# EAGLE design Power-Monitor-Module (EAGLE 9.6.2)
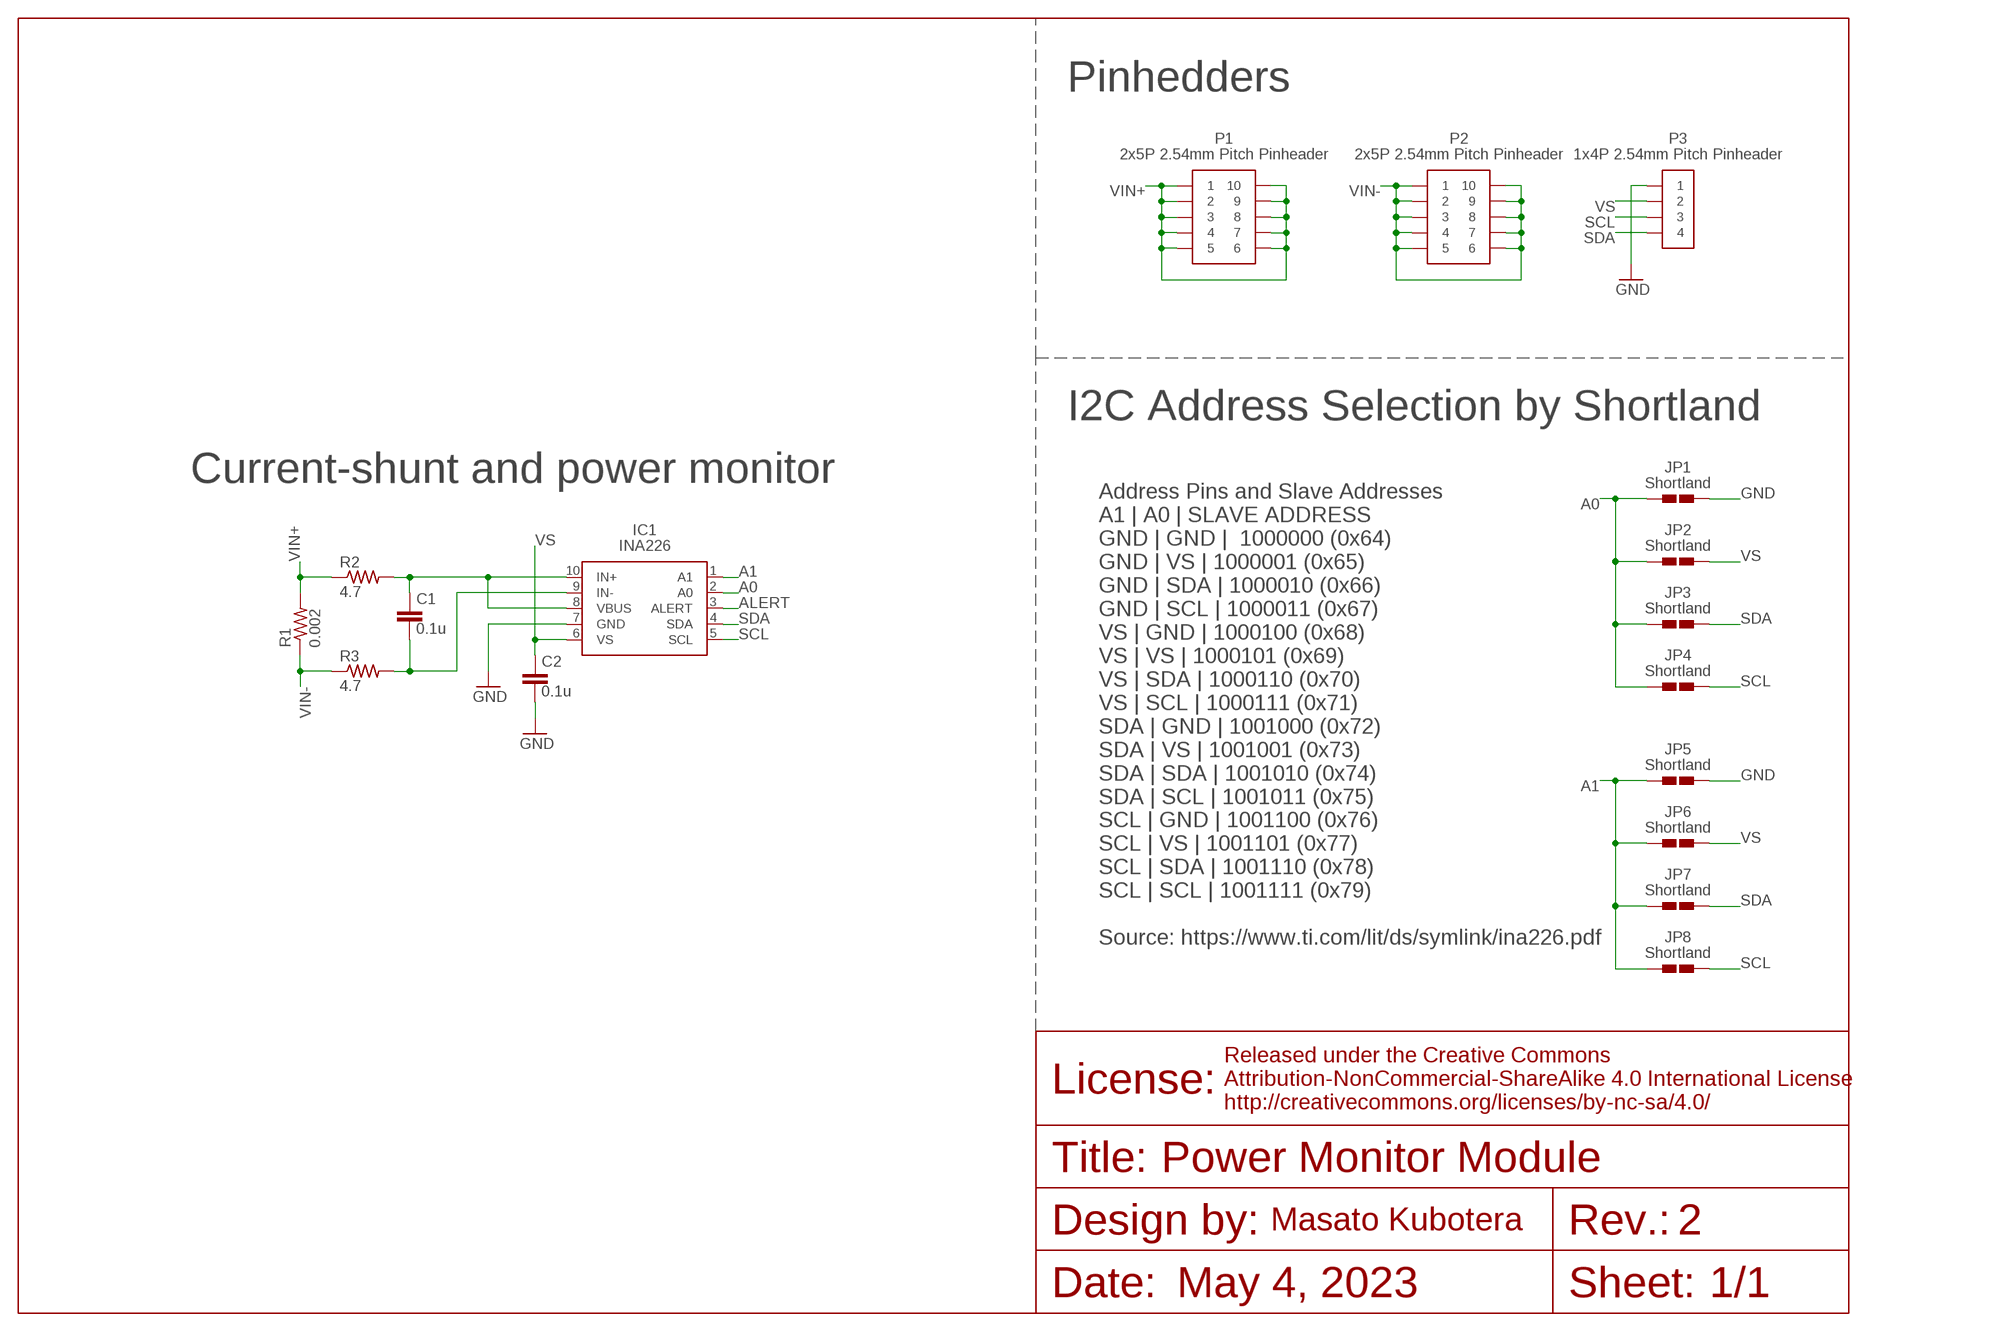
[diagram p0: schematic, sheet 1]

## Parts
C1  0.1u  C-EUC0402  [C0402]
C2  0.1u  C-EUC0402  [C0402]
IC1  INA226  [MSOP-10]
JP1  SHORTLAND  [SHORTLAND]
JP2  SHORTLAND  [SHORTLAND]
JP3  SHORTLAND  [SHORTLAND]
JP4  SHORTLAND  [SHORTLAND]
JP5  SHORTLAND  [SHORTLAND]
JP6  SHORTLAND  [SHORTLAND]
JP7  SHORTLAND  [SHORTLAND]
JP8  SHORTLAND  [SHORTLAND]
P1  2X5P  [2X5P]
P2  2X5P  [2X5P]
P3  1X4P  [1X4P]
R1  0.002  R-US_R2512  [R2512]
R2  4.7  R-US_R0402  [R0402]
R3  4.7  R-US_R0402  [R0402]

## Nets
A0 [data]: IC1.2(A0) JP1.1 JP2.1 JP3.1 JP4.1
A1 [data]: IC1.1(A1) JP5.1 JP6.1 JP7.1 JP8.1
ALERT [data]: IC1.3(ALERT)
GND [power]: C2.2 IC1.7(GND) JP1.2 JP5.2 P3.1
IN+ [power]: C1.1 IC1.8(VBUS) IC1.10(IN+) R2.2
IN- [power]: C1.2 IC1.9(IN-) R3.2
SCL [data]: IC1.5(SCL) JP4.2 JP8.2 P3.3
SDA [data]: IC1.4(SDA) JP3.2 JP7.2 P3.4
VIN+: P1.1 P1.2 P1.3 P1.4 P1.5 P1.6 P1.7 P1.8 P1.9 P1.10 R1.2 R2.1
VIN-: P2.1 P2.2 P2.3 P2.4 P2.5 P2.6 P2.7 P2.8 P2.9 P2.10 R1.1 R3.1
VS [power]: C2.1 IC1.6(VS) JP2.2 JP6.2 P3.2

## Notes on the sheet
- Pinhedders
- I2C Address Selection by Shortland
- Current-shunt and power monitor
- Address Pins and Slave Addresses
  A1 | A0 | SLAVE ADDRESS
  GND | GND |  1000000 (0x64)
  GND | VS | 1000001 (0x65)
  GND | SDA | 1000010 (0x66)
  GND | SCL | 1000011 (0x67)
  VS | GND | 1000100 (0x68)
  VS | VS | 1000101 (0x69)
  VS | SDA | 1000110 (0x70)
  VS | SCL | 1000111 (0x71)
  SDA | GND | 1001000 (0x72)
  SDA | VS | 1001001 (0x73)
  SDA | SDA | 1001010 (0x74)
  SDA | SCL | 1001011 (0x75)
  SCL | GND | 1001100 (0x76)
  SCL | VS | 1001101 (0x77)
  SCL | SDA | 1001110 (0x78)
  SCL | SCL | 1001111 (0x79)
  
  Source: https://www.ti.com/lit/ds/symlink/ina226.pdf
- Power Monitor Module
- 2
- May 4, 2023 | 1/1

## Library data of the parts
C1 C2 = rcl:C-EU: CAPACITOR, European symbol; SPICEPREFIX: C
IC1 = INA226:INA226
JP1-JP8 = Shortland:SHORTLAND
P1 P2 = Pinheader:2X5P
P3 = Pinheader:1X4P
R1-R3 = rcl:R-US_: RESISTOR, American symbol; SPICEPREFIX: R

## Net classes
1 data: width 0.152 mm
2 power: width 0.203 mm

## Board
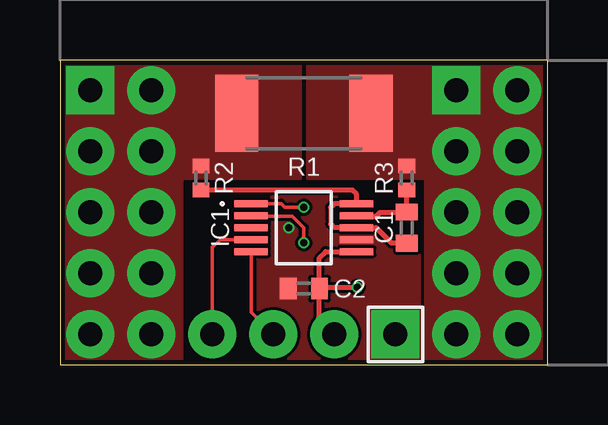
[diagram p1: board, top side]
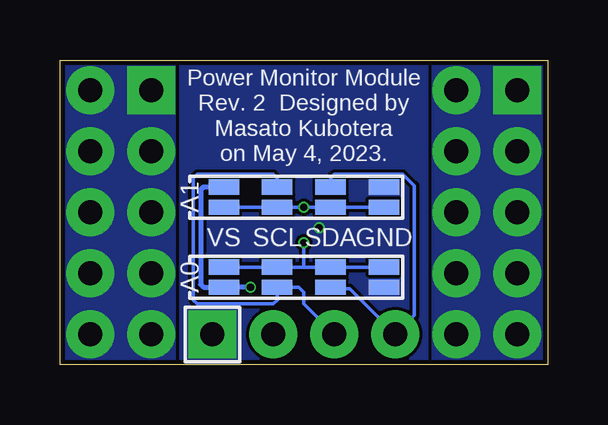
[diagram p2: board, bottom side, seen from below]

Size 20.32 x 12.7 mm. Coordinates in mm from the lower left corner, seen from the top.
Outline: 0,0 20.32,0 20.32,12.7 0,12.7 0,0
Copper layers (1*16): Top 0.035mm / dielectric 1.6mm / Bottom 0.035mm
Design rules "jlcpcb-2layers": minimum track width 5mil, minimum drill 0.3mm, track to track 5mil, track to pad 5mil, pad to pad 5mil, via to via 5mil, smd to smd 5mil, copper to edge 0.2mm, drill to drill 6mil, minimum pad ring 10mil, minimum via ring 3mil, stop-mask expansion 4mil, vias tented up to drill 0mil, thermal gap 10mil

### Footprints (pad centres in the part's own frame; a part is rotated, then mirrored left to right if it is on the bottom)
C0402 = smd 0.7 x 0.9: 1 -0.65,0; 2 0.65,0
MSOP-10 = smd 1.4 x 0.3: 1 -2.2,1; 2 -2.2,0.5; 3 -2.2,0; 4 -2.2,-0.5; 5 -2.2,-1; 6 2.2,-1; 7 2.2,-0.5; 8 2.2,0; 9 2.2,0.5; 10 2.2,1
SHORTLAND = smd 0.635 x 1.27: 1 -0.419,0; 2 0.419,0
2X5P = drill 1 pad 2 square: 1 -1.27,5.08 | drill 1 pad 2: 2 -1.27,2.54; 3 -1.27,0; 4 -1.27,-2.54; 5 -1.27,-5.08; 6 1.27,-5.08; 7 1.27,-2.54; 8 1.27,0; 9 1.27,2.54; 10 1.27,5.08
1X4P = drill 1 pad 2 square: 1 0,3.81 | drill 1 pad 2: 2 0,1.27; 3 0,-1.27; 4 0,-3.81
R2512 = smd 1.8 x 3.2: 1 -2.8,0; 2 2.8,0
R0402 = smd 0.6 x 0.7: 1 -0.5,0; 2 0.5,0

### Placement (x,y rotation side)
C1  14.45,5.71 90 top
C2  10.16,3.17 180 top
IC1  10.16,5.71 0 top
JP1  6.83,3.65 270 bottom
JP2  13.49,3.65 270 bottom
JP3  9.05,3.65 270 bottom
JP4  11.27,3.65 270 bottom
JP5  6.83,6.98 90 bottom
JP6  13.49,6.98 90 bottom
JP7  9.05,6.98 90 bottom
JP8  11.27,6.98 90 bottom
P1  2.54,6.35 0 top
P2  17.78,6.35 0 top
P3  10.16,1.27 270 top
R1  10.16,10.48 180 top
R2  5.87,7.78 270 top
R3  14.45,7.78 270 top

### Tracks (layer width: path | path; a pad name or v marks a point on that pad's centre or on a via)
A0  (via drill 0.3)
  Top 0.152: v10.16,5.08 10.16,5.71 9.68,6.19 8.1,6.19 IC1.2
  Bottom 0.152: JP1.1 JP3.1 10.16,4.07 | 13.49,4.13 JP2.1 JP4.1 | 11.21,4.13 JP4.1 | v10.16,5.08 10.16,4.07 | 10.16,4.07 JP4.1
A1  (via drill 0.3)
  Top 0.152: IC1.1 9.22,6.71 9.37,6.57 v10.16,6.57
  Bottom 0.152: JP5.1 JP7.1 v10.16,6.57 | JP6.1 JP8.1 v10.16,6.57 | v10.16,6.57 10.06,6.57
GND  (via drill 0.3)
  other vias: 9.53,5.71
  pour Bottom (rank 2, no thermals): -3.81,16.51 -3.81,-3.81 24.13,-3.81 24.13,16.51
  pour Top (rank 3, no thermals): -5.08,17.78 -5.08,-5.08 25.4,-5.08 25.4,17.78
IN+
  Top 0.203: C1.1 14.45,5.08 13.81,5.08 13.18,5.71 IC1.8 11.43,5.71 11.27,5.87 11.27,6.56 11.43,6.71 IC1.10 | R2.2 12.18,7.28 12.36,7.1 IC1.10 | IC1.10 12.34,6.74
IN-
  Top 0.203: R3.2 C1.2 14.45,6.35 13.34,6.35 13.18,6.19 12.38,6.19 IC1.9
SCL
  Top 0.152: IC1.5 7.96,2.2 P3.3
  Bottom 0.152: P3.3 10.16,2.54 10.16,3.02 10.38,3.23 JP4.2 11.27,2.7 11.43,2.54 14.61,2.54 14.76,2.7 14.76,7.78 14.61,7.94 11.43,7.94 11.27,7.78 JP8.2
SDA
  Top 0.152: P3.4 6.35,4.9 6.67,5.21 IC1.4
  Bottom 0.152: 8.89,3.02 9.05,3.17 JP3.2 8.99,3.17 8.26,3.17 P3.4 5.56,2.06 5.56,7.46 6.03,7.94 8.89,7.94 9.05,7.78 JP7.2
VIN+
  pour Top (no thermals): -1.27,13.97 -1.27,-1.27 5.08,-1.27 5.08,7.78 10,7.78 10,13.97
  pour Bottom (no thermals): -2.54,15.24 -2.54,-2.54 4.76,-2.54 4.76,15.24
VIN-
  pour Top (rank 2, no thermals): 10.32,13.97 10.32,7.78 15.24,7.78 15.24,-1.27 21.59,-1.27 21.59,13.97
  pour Bottom (no thermals): 15.56,15.24 15.56,-2.54 22.86,-2.54 22.86,15.24
VS  (via drill 0.3)
  Top 0.203: 10.95,3.17 C2.1 | P3.2 10.79,1.9 10.79,3.17 C2.1 | C2.1 10.81,4.46 11.06,4.71 IC1.6 | C2.1 10.87,3.23 v12.38,3.23
  Bottom 0.203: v12.38,3.23 JP2.2 14.34,3.23 14.46,3.35 14.46,7.29 14.34,7.4 JP6.2

### Text on the board
bPlace: Power Monitor Module / Rev. 2 Designed by / Masato Kubotera / on May 4, 2023. | A1 | GND | SDA | SCL | VS | A0